# EAGLE design sameh (EAGLE 8.5.1)
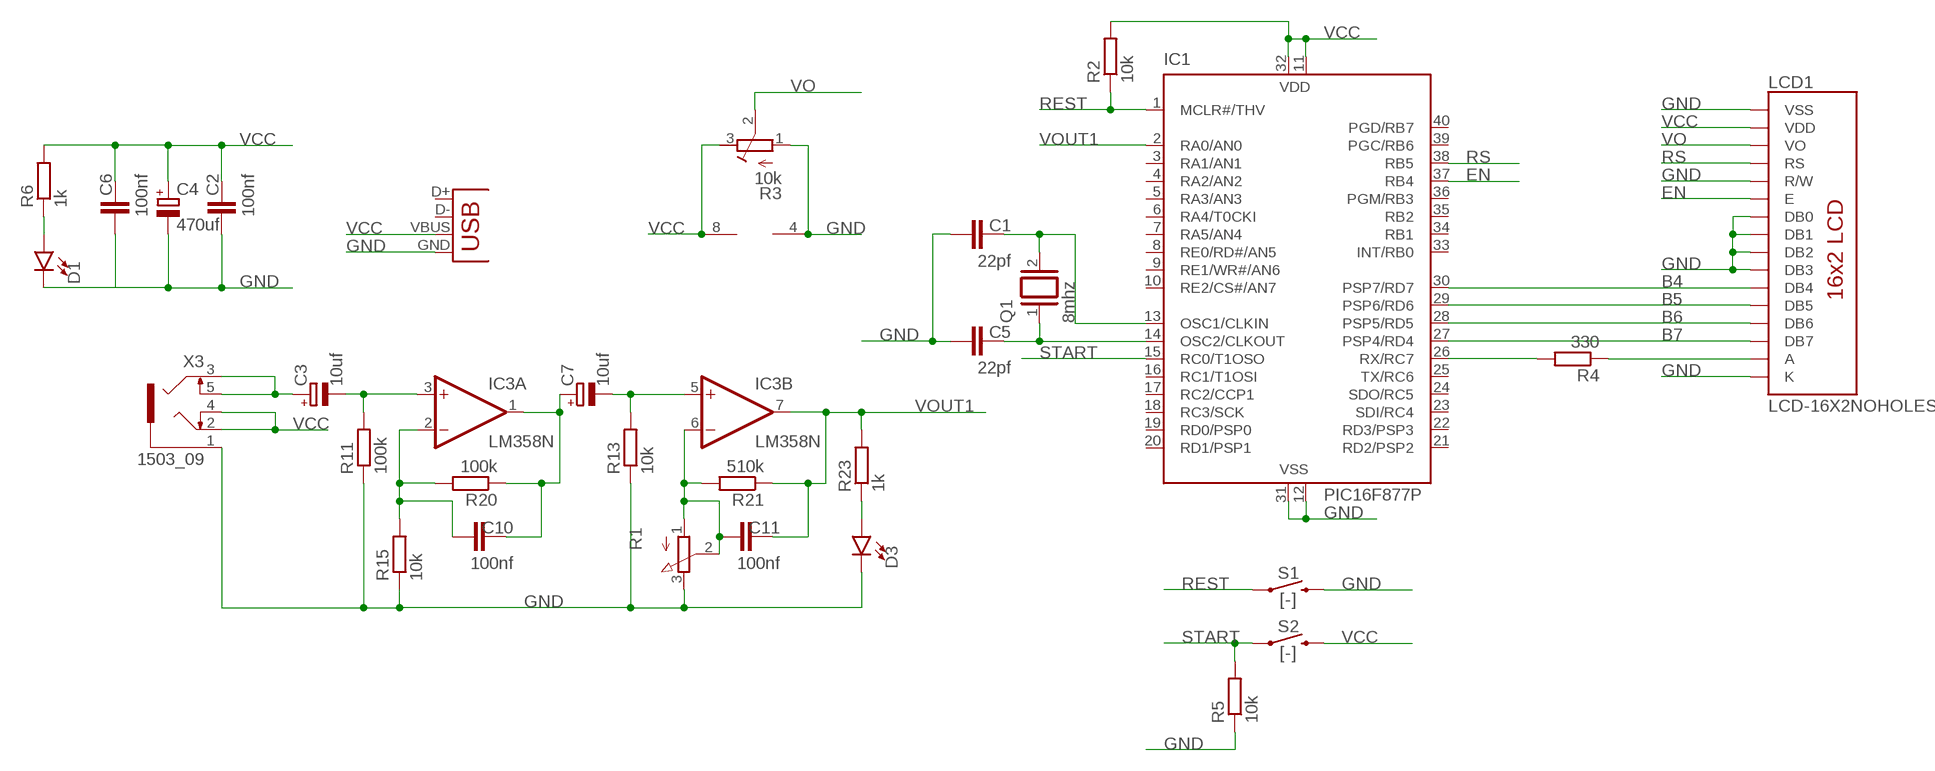
[diagram p0: schematic, sheet 1]

## Parts
C1  22pf  C-EU050-030X075  [C050-030X075]
C2  100nf  C-EU050-030X075  [C050-030X075]
C3  10uf  CPOL-EUE2-5  [E2-5]
C4  470uf  CPOL-EUE3.5-8  [E3,5-8]
C5  22pf  C-EU050-030X075  [C050-030X075]
C6  100nf  C-EU050-030X075  [C050-030X075]
C7  10uf  CPOL-EUE2-5  [E2-5]
C10  100nf  C-EU050-030X075  [C050-030X075]
C11  100nf  C-EU050-030X075  [C050-030X075]
D1  LED5MM  [LED_5MM]
D3  LED5MM  [LED_5MM]
IC1  PIC16F877P  [DIL40]
IC3  LM358N  [DIL08]
LCD1  LCD-16X2NOHOLES  [LCD-16X2_NOHOLESNOSILK]
Q1  8mhz  XTAL/S  [QS]
R1  3RP/1610N  [3RP/1610N]
R2  10k  R-EU_0207/10  [0207/10]
R3  10k  R-TRIMM64W  [RTRIM64W]
R4  330  R-EU_0207/10  [0207/10]
R5  10k  R-EU_0207/10  [0207/10]
R6  1k  R-EU_0207/10  [0207/10]
R11  100k  R-EU_0207/10  [0207/10]
R13  10k  R-EU_0207/10  [0207/10]
R15  10k  R-EU_0207/10  [0207/10]
R20  100k  R-EU_0207/10  [0207/10]
R21  510k  R-EU_0207/10  [0207/10]
R23  1k  R-EU_0207/10  [0207/10]
S1  [-]  MOMENTARY-SWITCH-SPST-PTH-6.0MM  [TACTILE_SWITCH_PTH_6.0MM]
S2  [-]  MOMENTARY-SWITCH-SPST-PTH-6.0MM  [TACTILE_SWITCH_PTH_6.0MM]
X2  USB-B-H  [USB-B-H]
X3  1503_09  [1503_09]

## Nets
B4: IC1.30(PSP7/RD7) LCD1.11(DB4)
B5: IC1.29(PSP6/RD6) LCD1.12(DB5)
B6: IC1.28(PSP5/RD5) LCD1.13(DB6)
B7: IC1.27(PSP4/RD4) LCD1.14(DB7)
EN: IC1.37(RB4) LCD1.6(E)
GND: C1.1 C2.1 C4.- C5.1 C6.1 D1.K(C) D3.K(C) IC1.12(VSS) IC1.31(VSS) IC3.4(P:V-) LCD1.1(VSS) LCD1.5(R/W) LCD1.7(DB0) LCD1.8(DB1) LCD1.9(DB2) LCD1.10(DB3) LCD1.16(K) R1.3(E) R3.1(A) R5.1 R11.1 R13.1 R15.1 S1.3 X2.GND X3.1
N$1: C1.2 IC1.13(OSC1/CLKIN) Q1.2
N$2: C5.2 IC1.14(OSC2/CLKOUT) Q1.1
N$3: IC1.26(RX/RC7) R4.2
N$4: LCD1.15(A) R4.1
N$5: D1.A R6.1
N$12: C7.+ C10.2 IC3.1(A:OUT) R20.1
N$13: C10.1 IC3.2(A:-IN) R15.2 R20.2
N$15: C11.1 IC3.6(B:-IN) R1.1(A) R1.2(S) R21.2
N$23: C3.+ X3.3 X3.5
N$26: C7.- IC3.5(B:+IN) R13.2
N$35: C3.- IC3.3(A:+IN) R11.2
N$36: D3.A R23.1
REST: IC1.1(MCLR#/THV) R2.1 S1.1
RS: IC1.38(RB5) LCD1.4(RS)
START: IC1.15(RC0/T1OSO) R5.2 S2.1
VCC: C2.2 C4.+ C6.2 IC1.11(VDD) IC1.32(VDD) IC3.8(P:V+) LCD1.2(VDD) R2.2 R3.3(E) R6.2 S2.3 X2.VBUS X3.2 X3.4
VO: LCD1.3(VO) R3.2(S)
VOUT1: C11.2 IC1.2(RA0/AN0) IC3.7(B:OUT) R21.1 R23.2
Unconnected: IC1.3(RA1/AN1) IC1.4(RA2/AN2) IC1.5(RA3/AN3) IC1.6(RA4/T0CKI) IC1.7(RA5/AN4) IC1.8(RE0/RD#/AN5) IC1.9(RE1/WR#/AN6) IC1.10(RE2/CS#/AN7) IC1.16(RC1/T1OSI) IC1.17(RC2/CCP1) IC1.18(RC3/SCK) IC1.19(RD0/PSP0) IC1.20(RD1/PSP1) IC1.21(RD2/PSP2) IC1.22(RD3/PSP3) IC1.23(SDI/RC4) IC1.24(SDO/RC5) IC1.25(TX/RC6) IC1.33(INT/RB0) IC1.34(RB1) IC1.35(RB2) IC1.36(PGM/RB3) IC1.39(PGC/RB6) IC1.40(PGD/RB7) X2.D+ X2.D-

## Library data of the parts
C1 C2 C5 C6 C10 C11 = rcl:C-EU: CAPACITOR, European symbol; SPICEPREFIX: C
C3 C4 C7 = rcl:CPOL-EU: POLARIZED CAPACITOR, European symbol; SPICEPREFIX: C
D1 D3 = SparkFun-LED:LED: LED (Generic) Standard schematic elements and footprints for 5mm, 3mm, 1206, and 0603 sized LEDs. Generic LEDs with no color specified.
IC1 = microchip-2:PIC16F87*: MICROCONTROLLER
IC3 = linear:LM358: OP AMP also LM158; LM258; LM2904 Source: http://cache.national.com/ds/LM/LM158.pdf
LCD1 = SparkFun-Displays:LCD-16X2: Standard text-only 16x2 parallel input LCD Basic 16 character by 2 line display. Typically utilizes the extremely common HD44780 parallel interface chipset SparkFun Products: Basic 16x2 Green <https://www.sparkfun.com/products/255> Basic 8x2 Green <https://www.sparkfun.com/products/11122>; SF_ID: LCD-00255
Q1 = special:XTAL/S: CRYSTAL
R1 = pot:3RP/1610N: 16mm Potentiometer one level Source: http://www.alphapotentiometers.net/html/16mm_pot_2.html
R2 R4-R6 R11 R13 R15 R20 R21 R23 = rcl:R-EU_: RESISTOR, European symbol; SPICEPREFIX: R
R3 = rcl:R-TRIMM: Trimm resistor; SPICEMODEL: X; SPICEPREFIXL: POT
S1 S2 = SparkFun-Switches:MOMENTARY-SWITCH-SPST: Momentary Switch (Pushbutton) - SPST Normally-open (NO) SPST momentary switches (buttons, pushbuttons). Variants PTH-12MM - 12mm square, through-hole Momentary Pushbutton Switch - 12mm Square <https://www.sparkfun.com/products/9190> (COM-09190) PTH-6.0MM, PTH-6.0MM-KIT - 6.0mm square, through-hole Mini Pushbutton Switch <https://www.sparkfun.com/products/97> (COM-00097) KIT package intended for soldering kit's - only one side of pads' copper is exposed. PTH-RIGHT-ANGLE-KIT - Right-angle, through-hole Right Angle Tactile Button <https://www.sparkfun.com/products/10791> - Used on SparkFun BigTime Watch Kit <https://www.sparkfun.com/products/11734> SMD-12MM - 12mm square, surface-mount Tactile Button - SMD (12mm) <https://www.sparkfun.com/products/12993> (COM-12993) Used on SparkFun PicoBoard <https://www.sparkfun.com/products/11888> SMD-4.5MM - 4.5mm Square Trackball Switch Used on SparkFun Blackberry Trackballer Breakout <https://www.sparkfun.com/products/13169> SMD-4.6MMX2.8MM - 4.60mm x 2.80mm, surface mount Used on SparkFun SAMD21 Mini Breakout <https://www.sparkfun.com/products/13664> SMD-5.2MM, SMD-5.2-REDUNDANT - 5.2mm square, surface-mount Mini Pushbutton Switch - SMD <https://www.sparkfun.com/products/8720> (COM-08720) Used on Arduino Pro Mini <https://www.sparkfun.com/products/11114> REDUNDANT package connects both switch circuits together SMD-6.0X3.5MM - 6.0 x 3.5mm, surface mount Momentary Reset Switch SMD <https://www.sparkfun.com/products/8229> (COM-08229) SMD-6.2MM-TALL - 6.2mm square, surface mount Tactile Button - SMD (6mm) <https://www.sparkfun.com/products/12992> Used on SparkFun Digital Sandbox <https://www.sparkfun.com/products/12651> SMD-RIGHT-ANGLE - Right-angle, surface mount Used on SparkFun Block for Intel® Edison - Arduino <https://www.sparkfun.com/products/13036>; PROD_ID: SWCH-08441; SF_SKU: COM-00097
X2 = con-usb:USB: USB Connectors
X3 = con-lumberg:1503_09: Jack connectors according to JISC 6560, 3.5 mm Klinkeneinbaukupplung nach JISC 6560, 3,5 mm, 3-polig/ stereo, abgewinkelte Ausführung, mit 2 Öffnern und Lötaugen, für Leiterplatten Rückseitenmontage Source: http://www.lumberg.com/Produkte/PDFs/1503_09.pdf; OC_FARNELL: 1243244; OC_NEWARK: unknown

## Board
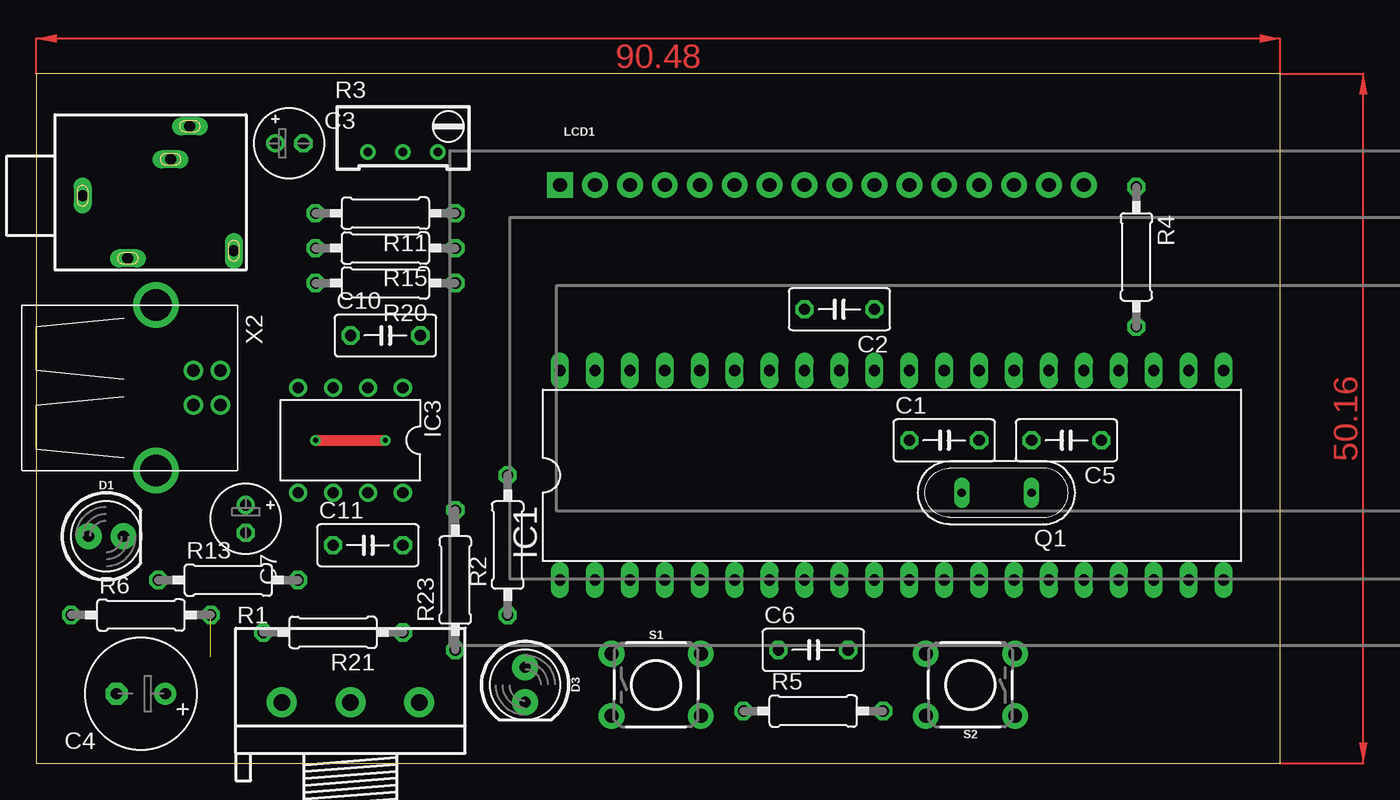
[diagram p1: board, top side]
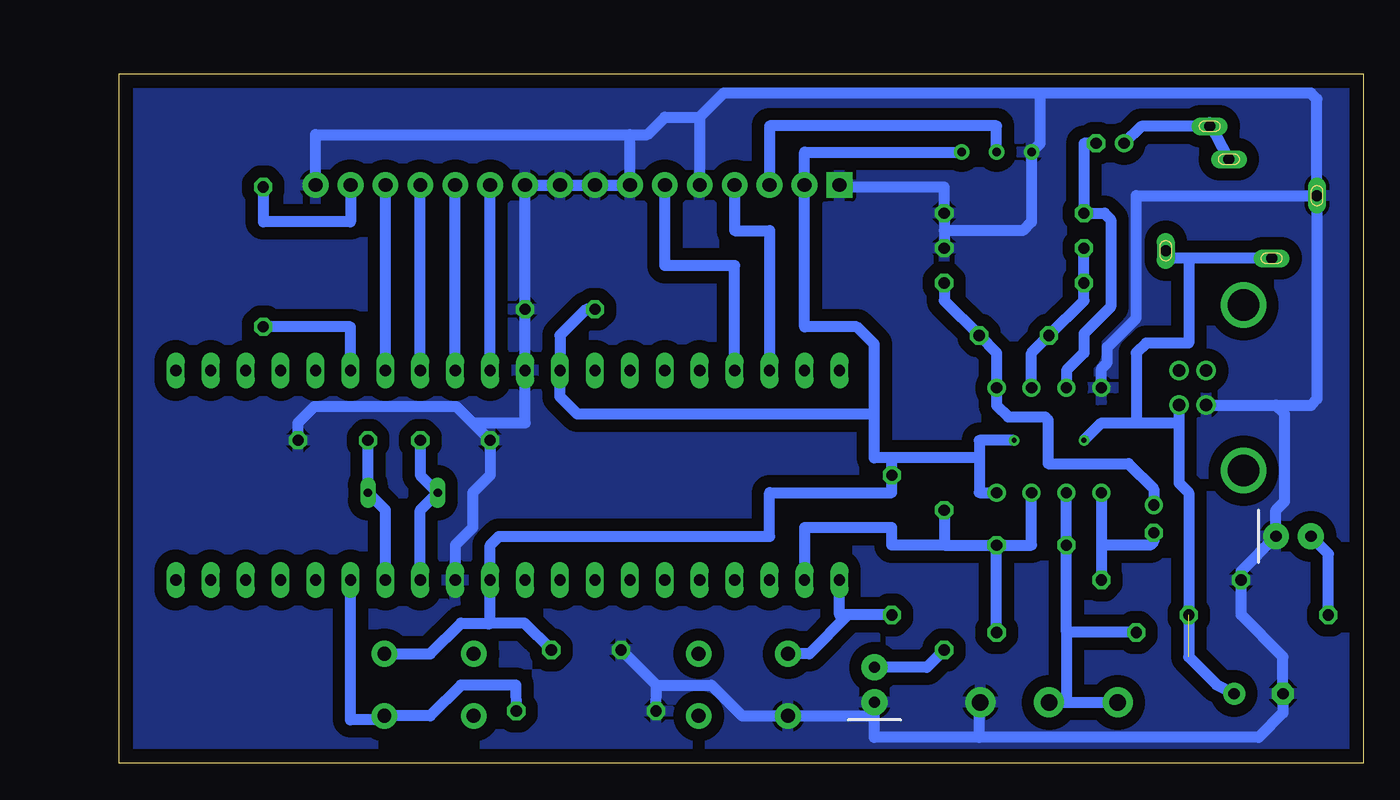
[diagram p2: board, bottom side, seen from below]

Size 90.48 x 50.16 mm. Coordinates in mm from the lower left corner, seen from the top.
Outline: 0,0 90.48,0 90.48,50.16 0,50.16 0,0
Copper layers (1*16): Top 0.035mm / dielectric 1.5mm / Bottom 0.035mm
Design rules "default *": minimum track width 30mil, minimum drill 0.35mm, track to track 35mil, track to pad 35mil, pad to pad 6mil, via to via 6mil, smd to smd 6mil, copper to edge 40mil, drill to drill 6mil, minimum pad ring 10mil, minimum via ring 8mil, stop-mask expansion 4mil, vias tented up to drill 0mil, thermal gap 10mil

### Footprints (pad centres in the part's own frame; a part is rotated, then mirrored left to right if it is on the bottom)
C050-030X075 = drill 0.813 octagon: 1 -2.54,0; 2 2.54,0
E2-5 = drill 0.813 pad 1.27: + -1.016,0 | drill 0.813 pad 1.27 octagon: - 1.016,0
E3,5-8 = drill 0.813 pad 1.6: + -1.778,0 | drill 0.813 pad 1.6 octagon: - 1.778,0
LED_5MM = drill 0.813 pad 1.88: A -1.27,0; K 1.27,0
DIL40 = drill 0.813 long: 1 -24.13,-7.62; 2 -21.59,-7.62; 3 -19.05,-7.62; 4 -16.51,-7.62; 5 -13.97,-7.62; 6 -11.43,-7.62; 7 -8.89,-7.62; 8 -6.35,-7.62; 9 -3.81,-7.62; 10 -1.27,-7.62; 11 1.27,-7.62; 12 3.81,-7.62; 13 6.35,-7.62; 14 8.89,-7.62; 15 11.43,-7.62; 16 13.97,-7.62; 17 16.51,-7.62; 18 19.05,-7.62; 19 21.59,-7.62; 20 24.13,-7.62; 21 24.13,7.62; 22 21.59,7.62; 23 19.05,7.62; 24 16.51,7.62; 25 13.97,7.62; 26 11.43,7.62; 27 8.89,7.62; 28 6.35,7.62; 29 3.81,7.62; 30 1.27,7.62; 31 -1.27,7.62; 32 -3.81,7.62; 33 -6.35,7.62; 34 -8.89,7.62; 35 -11.43,7.62; 36 -13.97,7.62; 37 -16.51,7.62; 38 -19.05,7.62; 39 -21.59,7.62; 40 -24.13,7.62
DIL08 = drill 0.813 pad 1.27: 1 -3.81,-3.81; 2 -1.27,-3.81; 3 1.27,-3.81; 4 3.81,-3.81; 5 3.81,3.81; 6 1.27,3.81; 7 -1.27,3.81; 8 -3.81,3.81
LCD-16X2_NOHOLESNOSILK = drill 1.016 pad 1.88 square: 1 -32,15.5 | drill 1.016 pad 1.88: 2 -29.46,15.5; 3 -26.92,15.5; 4 -24.38,15.5; 5 -21.84,15.5; 6 -19.3,15.5; 7 -16.76,15.5; 8 -14.22,15.5; 9 -11.68,15.5; 10 -9.14,15.5; 11 -6.6,15.5; 12 -4.06,15.5; 13 -1.52,15.5; 14 1.02,15.5; 15 3.56,15.5; 16 6.1,15.5
QS = drill 0.61 long: 1 -2.54,0; 2 2.54,0
3RP/1610N = drill 1.2 pad 2.184: 1 -5,0; 2 0,0; 3 5,0
0207/10 = drill 0.813 octagon: 1 -5.08,0; 2 5.08,0
RTRIM64W = drill 0.61: 1 1.27,-2.54; 2 1.27,0; 3 1.27,2.54
TACTILE_SWITCH_PTH_6.0MM = drill 1.016 pad 1.88: 1 -3.251,2.261; 2 3.251,2.261; 3 -3.251,-2.261; 4 3.251,-2.261
USB-B-H = drill 0.914: D+ 0,1.25; D- 1.981,1.25; GND 0,-1.25; VBUS 1.981,-1.25 | drill 2.286: P$1 -2.718,-6.02; P$2 -2.718,6.02
1503_09 = drill 0.8 pad 1.2 long: 1 0,-2.1; 2 -4.55,-5.4; 3 5.05,-9.9; 4 -4,-13.1; 5 2.65,-8.5

### Placement (x,y rotation side)
C1  66.04,23.5 0 top
C2  58.42,33.02 180 top
C3  18.42,45.09 0 top
C4  7.62,5.08 180 top
C5  74.93,23.5 180 top
C6  56.52,8.26 0 top
C7  15.24,17.78 270 top
C10  25.4,31.12 0 top
C11  24.13,15.87 0 top
D1  5.08,16.51 0 top
D3  35.56,5.71 270 top
IC1  62.23,20.95 0 top
IC3  22.86,23.5 180 top
LCD1  70.1,26.55 0 top
Q1  69.85,19.69 180 top
R1  22.86,4.45 0 top
R2  34.29,15.87 90 top
R3  26.67,45.72 270 top
R4  80.01,36.83 270 top
R5  56.52,3.81 0 top
R6  7.62,10.79 0 top
R11  25.4,40.01 180 top
R13  13.97,13.33 0 top
R15  25.4,37.47 180 top
R20  25.4,34.93 180 top
R21  21.59,9.53 180 top
R23  30.48,13.33 90 top
S1  45.09,5.71 0 top
S2  67.95,5.71 180 top
X2  11.43,27.3 0 top
X3  1.27,41.27 90 top

### Tracks (layer width: path | path; a pad name or v marks a point on that pad's centre or on a via)
B4
  Bottom 0.813: IC1.30 LCD1.11
B5
  Bottom 0.813: IC1.29 LCD1.12
B6
  Bottom 0.813: IC1.28 LCD1.13
B7
  Bottom 0.813: IC1.27 LCD1.14
EN
  Bottom 0.813: IC1.37 45.72,36.2 50.8,36.2 LCD1.6
GND
  Bottom 0.813: 30.48,38.73 R11.1 30.48,41.91 37.95,41.91 LCD1.1 | 30.48,38.73 R15.1 | X2.GND 6.35,26.05 | 6.35,26.05 3.83,26.05 | 3.83,26.05 3.81,26.04 | X3.1 3.37,26.52 3.83,26.05 | IC3.4 19.05,28.71 18.62,29.14 18.62,30.28 16.51,32.38 16.51,41.27 X3.1 | X3.1 3.37,48.29 3.81,48.73 23.5,48.73 | C5.1 77.47,24.77 76.28,25.96 65.96,25.96 64.77,24.77 | 64.77,24.77 C1.1 63.5,20.95 64.77,19.69 64.77,17.15 66.04,15.87 IC1.12 | 64.77,24.77 60.96,24.77 IC1.31 C2.1 LCD1.10 LCD1.9 LCD1.8 LCD1.7 53.34,45.72 | 27.94,1.9 7.62,1.9 5.84,3.68 C4.- 5.84,7.75 8.89,10.79 R13.1 8.89,13.97 D1.K | 27.94,1.9 27.94,4.37 R1.3 | 27.94,1.9 35.56,1.9 35.56,3.17 | 35.56,3.17 D3.K | 35.56,3.17 35.84,3.45 S1.3 45.17,3.45 47.41,5.69 51.41,5.69 | 23.5,48.73 23.5,45.09 R3.1 24.13,39.37 24.77,38.73 30.48,38.73 | 48.26,46.99 LCD1.5 | 53.34,45.72 52.07,45.72 50.8,46.99 48.26,46.99 | 23.5,48.73 46.52,48.73 48.26,46.99 | LCD1.16 76.2,45.72 53.34,45.72 | R5.1 51.41,5.69 | C6.1 51.41,5.69 | D1.K 6.35,17.15 | 6.35,26.05 5.72,25.42 5.72,19.05 6.35,18.41 D1.K
  pour Bottom: 0.64,50.16 88.9,50.16 90.17,48.9 90.17,0.63 88.9,-0.63 1.27,-0.63 0.64,0.63
N$1
  Bottom 0.813: IC1.13 68.58,18.41 Q1.2 68.58,20.95 C1.2
N$2
  Bottom 0.813: IC1.14 71.12,18.41 Q1.1 C5.2
N$3
  Bottom 0.813: IC1.26 73.66,31.75 R4.2
N$4
  Bottom 0.813: R4.1 80.01,39.37 73.66,39.37 LCD1.15
N$5
  Bottom 0.813: D1.A 2.54,15.24 R6.1
N$12
  Bottom 0.813: R20.1 30.48,33.66 C10.2 26.67,29.84 IC3.1 26.67,26.04 25.83,25.2 23.16,25.2 22.93,24.97 22.93,21.79 17.08,21.79 15.24,19.96 C7.+
N$13
  Bottom 0.813: IC3.2 24.13,29.84 C10.1 20.32,33.66 R20.2 R15.2
N$15
  Bottom 0.813: R21.2 21.59,9.53 | 21.59,9.53 C11.1 IC3.6 | R1.2 21.59,4.45 | 21.59,4.45 R1.1 | 21.59,9.53 21.59,4.45
N$23
  Bottom 0.813: X3.5 11.17,46.59 X3.3 16.16,46.33 C3.+
N$26
  Bottom 0.813: IC3.5 19.05,15.87 | 19.05,15.87 R13.2 | 19.05,15.87 15.49,15.87 15.24,16.13 C7.-
N$35
  Bottom 0.813: C3.- 20.32,45.09 R11.2 18.82,40.01 18.36,39.55 18.36,33.2 20.32,31.25 20.32,29.84 21.59,28.58 IC3.3
N$36
  Bottom 0.813: R23.1 31.75,6.99 D3.A
REST
  Bottom 0.813: R2.1 37.47,10.79 | 37.47,10.79 38.1,10.79 IC1.1 | 37.47,10.79 40.28,7.98 S1.1
RS
  Bottom 0.813: LCD1.4 45.72,38.73 43.18,38.73 IC1.38
START
  Bottom 0.813: R5.2 61.62,5.69 65.62,5.69 67.86,3.45 S2.1 71.48,3.17 73.66,3.17 IC1.15
VCC  (via drill 0.35)  (1 unrouted)
  Top 0.813: v20.32,23.5 v25.4,23.5
  Bottom 0.813: X3.2 12.7,36.73 | 12.7,36.73 13.82,36.73 X3.4 | X2.VBUS 13.41,24.77 | 16.51,24.77 16.51,29.84 15.79,30.56 12.7,30.56 12.7,36.73 | 16.51,24.77 13.41,24.77 | v25.4,23.5 27.94,23.5 27.94,22.23 | 27.94,22.23 27.94,19.69 IC3.8 | 13.41,24.77 13.41,20.4 12.7,19.69 12.7,7.75 10.67,5.71 C4.+ | 27.94,22.23 34.29,22.23 | 34.29,22.23 35.56,22.23 35.56,25.4 | 34.29,22.23 R2.2 34.29,19.69 43.18,19.69 43.18,16.51 62.87,16.51 63.5,15.87 IC1.11 63.5,10.16 63.72,10.16 63.77,10.21 | v20.32,23.5 19.05,24.77 16.51,24.77 | R3.3 40.64,44.45 LCD1.2 40.64,31.75 36.83,31.75 35.56,30.48 35.56,25.4 | C2.2 56.52,33.02 58.42,31.12 IC1.32 58.42,26.67 57.15,25.4 35.56,25.4 | 63.77,10.21 65.62,10.21 67.86,7.98 S2.3 | C6.2 61.01,10.21 63.77,10.21
VO
  Bottom 0.813: R3.2 26.67,46.36 43.18,46.36 LCD1.3
VOUT1
  Bottom 0.813: R21.1 C11.2 | C11.2 24.13,15.87 IC3.7 | R23.2 30.48,15.87 | 30.48,15.87 C11.2 | 30.48,15.87 34.29,15.87 34.29,17.15 40.64,17.15 IC1.2
(copper drawn outside any net)
  shapes: Top area x2